# Altium schematic sheet pinout_v1.SchDoc
size A
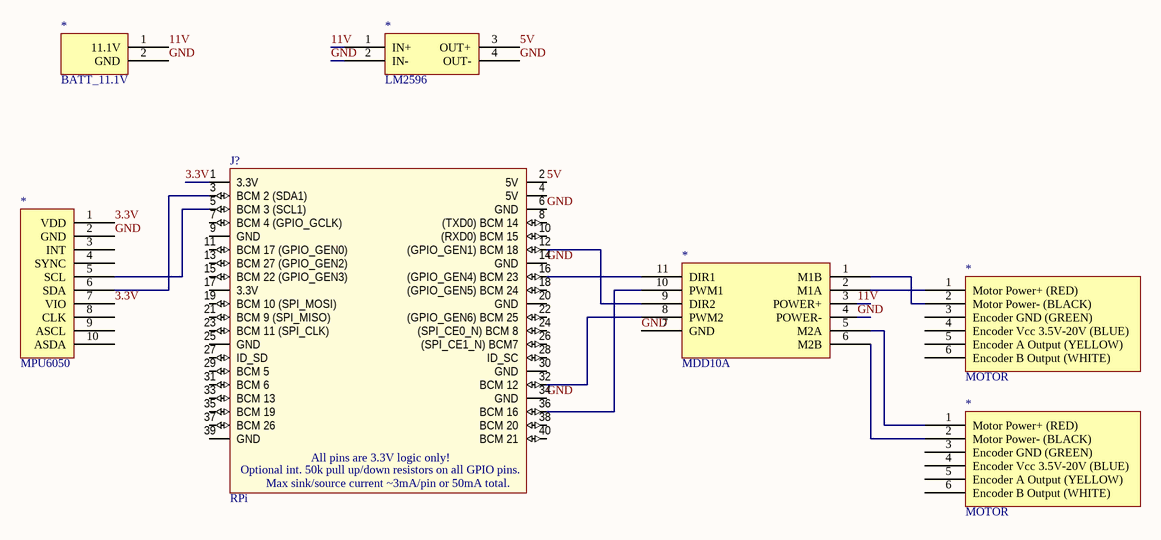
[diagram p0: pinout_v1.SchDoc]

## Parts
(Parts that share a designator on the sheet are numbered #1, #2 ... from top to bottom, then left to right.)
*#1  BATT_11.1V
*#2  LM2596
*#3  MPU6050
*#4  MDD10A
*#5  MOTOR
*#6  MOTOR
J?  RPi  [40-Pin IDC Connector 2.54mm Pitch]

## Nets
3.3V: *#3.1(VDD) *#3.7(VIO) J?.1(3.3V)
5V: *#2.3(OUT+) J?.2(5V)
11V: *#1.1(11.1V) *#2.1(IN+) *#4.3(POWER+)
GND: *#1.2(GND) *#2.2(IN-) *#2.4(OUT-) *#3.2(GND) *#4.4(POWER-) *#4.7(GND) J?.6(GND) J?.14(GND) J?.34(GND)
Net*#3_5: *#3.5(SCL) J?.5(BCM_3_(SCL1))
Net*#3_6: *#3.6(SDA) J?.3(BCM_2_(SDA1))
Net*#4_1: *#4.1(M1B) *#5.2(Motor_Power-_(BLACK))
Net*#4_2: *#4.2(M1A) *#5.1(Motor_Power+_(RED))
Net*#4_5: *#4.5(M2A) *#6.1(Motor_Power+_(RED))
Net*#4_6: *#4.6(M2B) *#6.2(Motor_Power-_(BLACK))
Net*#4_8: *#4.8(PWM2) J?.32(BCM_12)
Net*#4_9: *#4.9(DIR2) J?.12((GPIO_GEN1)_BCM_18)
Net*#4_10: *#4.10(PWM1) J?.36(BCM_16)
Net*#4_11: *#4.11(DIR1) J?.16((GPIO_GEN4)_BCM_23)

Not connected (* = marked no-connect by the designer): *#3 3(INT) 4(SYNC) 8(CLK) 9(ASCL) 10(ASDA); *#5 3(Encoder_GND_(GREEN)) 4(Encoder_Vcc_3.5V-20V_(BLUE)) 5(Encoder_A_Output_(YELLOW)) 6(Encoder_B_Output_(WHITE)); *#6 3(Encoder_GND_(GREEN)) 4(Encoder_Vcc_3.5V-20V_(BLUE)) 5(Encoder_A_Output_(YELLOW)) 6(Encoder_B_Output_(WHITE)); J? 4(5V) 7(BCM_4_(GPIO_GCLK)) 8((TXD0)_BCM_14) 9(GND) 10((RXD0)_BCM_15) 11(BCM_17_(GPIO_GEN0)) 13(BCM_27_(GPIO_GEN2)) 15(BCM_22_(GPIO_GEN3)) 17(3.3V) 18((GPIO_GEN5)_BCM_24) 19(BCM_10_(SPI_MOSI)) 20(GND) 21(BCM_9_(SPI_MISO)) 22((GPIO_GEN6)_BCM_25) 23(BCM_11_(SPI_CLK)) 24((SPI_CE0_N)_BCM_8) 25(GND) 26((SPI_CE1_N)_BCM7) 27(ID_SD) 28(ID_SC) 29(BCM_5) 30(GND) 31(BCM_6) 33(BCM_13) 35(BCM_19) 37(BCM_26) 38(BCM_20) 39(GND) 40(BCM_21)

## Notes on the sheet
- (in symbol RPi) All pins are 3.3V logic only!; Optional int. 50k pull up/down resistors on all GPIO pins.; Max sink/source current ~3mA/pin or 50mA total.

## Library data of the parts
*#1 = BATT_11.1V: 11.1V, 4000mAh, 40C 3S LiPo Battery
*#2 = LM2596: DZS Elec 2PCS LM2596 DC-DC Step Down Variable Volt Regulator Input 3.2V-40V Output 1.25V-35V Adjustable Buck Converter Electronic Voltage Stabilizer Power Supply Module
*#3 = MPU6050: SparkFun Triple Axis Accelerometer and Gyro Breakout
*#4 = MDD10A: Cytron 10A 5-30V Dual Channel DC Motor Driver
*#5 *#6 = MOTOR: 30:1 Metal Gearmotor 37Dx68L mm with 64 CPR Encoder
J? = RPi: 40-pin IDC 2.54mm P Header with RPi 2+ GPIO pinout; Connector Manufacturer: TE Connectivity; RPi GPIO Pinout: https://pinout.xyz/; Connector Datasheet: http://www.mouser.com/ds/2/418/NG_CD_1761603_B1-619330.pdf; Mouser Part #: 571-3-1761603-3; Adafruit Cable: https://www.adafruit.com/product/1988